# Altium schematic sheet Z_Extruder_Motor_Drivers.SchDoc
size A
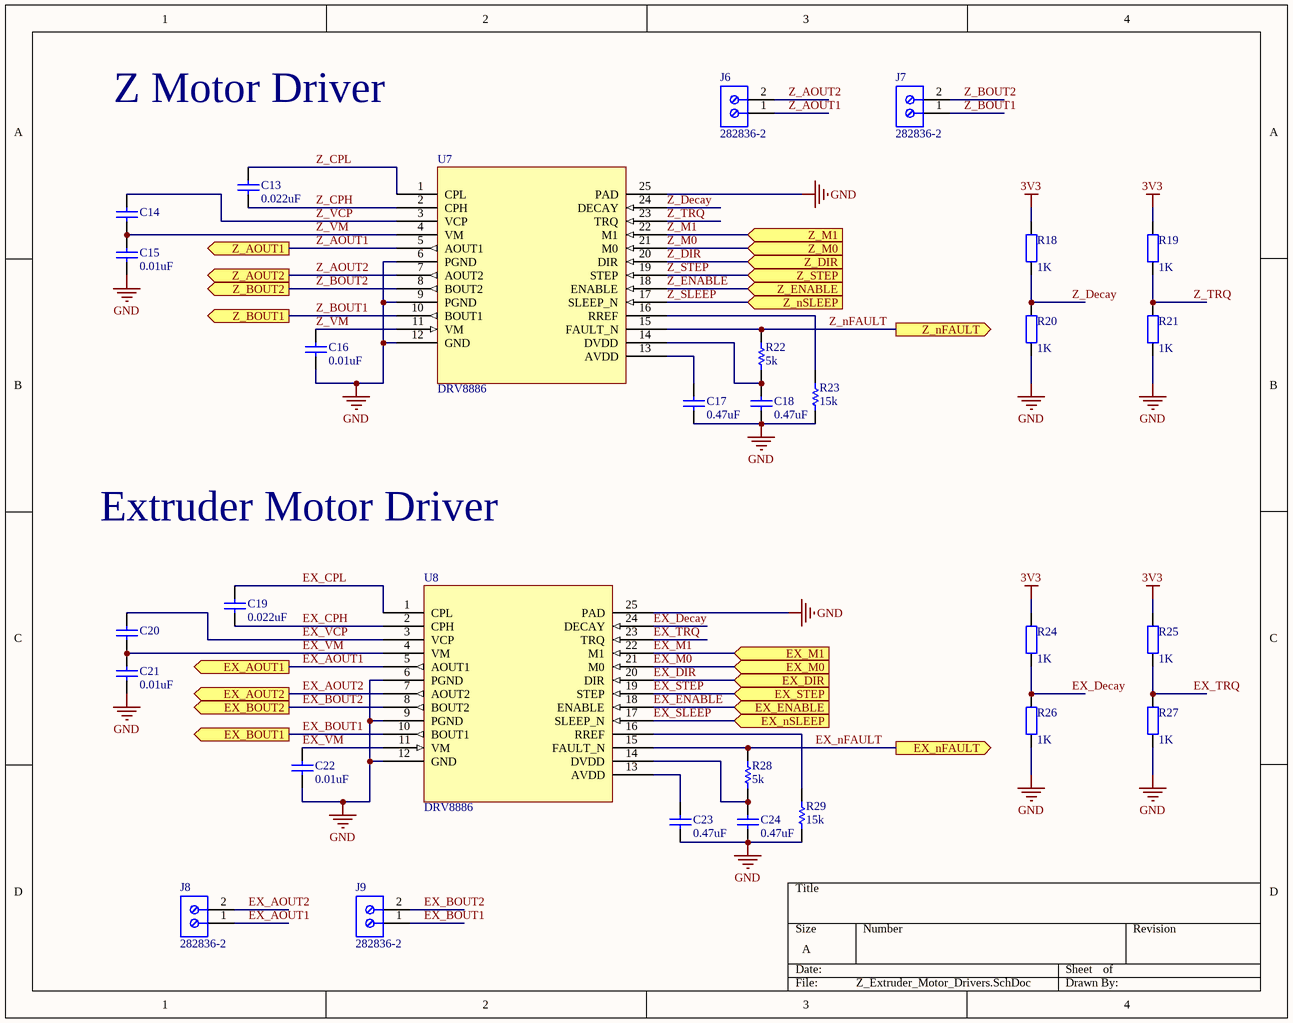
[diagram p0: Z_Extruder_Motor_Drivers.SchDoc]

## Parts
C13  0.022uF  [CAPC1608X87X35ML15T15]
C14  0.22uF  [TDK-C1608-2_A_M]  (value not drawn)
C15  0.01uF  [CAPC1608X87X35LL15T15]
C16  0.01uF  [CAPC1608X87X35LL15T15]
C17  0.47uF  [CAPC1608X90X35ML15T15]
C18  0.47uF  [CAPC1608X90X35ML15T15]
C19  0.022uF  [CAPC1608X87X35ML15T15]
C20  0.22uF  [TDK-C1608-2_A_M]  (value not drawn)
C21  0.01uF  [CAPC1608X87X35LL15T15]
C22  0.01uF  [CAPC1608X87X35LL15T15]
C23  0.47uF  [CAPC1608X90X35ML15T15]
C24  0.47uF  [CAPC1608X90X35ML15T15]
J6  282836-2  [TECO-282836-2_V]
J7  282836-2  [TECO-282836-2_V]
J8  282836-2  [TECO-282836-2_V]
J9  282836-2  [TECO-282836-2_V]
R18  value 1K  [AXIAL-0.4]  (hidden comment: ?)
R19  value 1K  [AXIAL-0.4]  (hidden comment: ?)
R20  value 1K  [AXIAL-0.4]  (hidden comment: Res2)
R21  value 1K  [AXIAL-0.4]  (hidden comment: Res2)
R22  5k  [RESC1608X55X25ML10T15]
R23  15k  [RESC1608X55X25ML10T15]
R24  value 1K  [AXIAL-0.4]  (hidden comment: ?)
R25  value 1K  [AXIAL-0.4]  (hidden comment: ?)
R26  value 1K  [AXIAL-0.4]  (hidden comment: Res2)
R27  value 1K  [AXIAL-0.4]  (hidden comment: Res2)
R28  5k  [RESC1608X55X25ML10T15]
R29  15k  [RESC1608X55X25ML10T15]
U7  DRV8886  [PWP0024B_N]
U8  DRV8886  [PWP0024B_N]

## Ports
EX_AOUT1 (out), EX_AOUT2 (out), EX_BOUT1 (out), EX_BOUT2 (out), EX_DIR (in), EX_ENABLE (in), EX_M0 (in), EX_M1 (in), EX_nFAULT (out), EX_nSLEEP (in), EX_STEP (in), Z_AOUT1 (out), Z_AOUT2 (out), Z_BOUT1 (out), Z_BOUT2 (out), Z_DIR (in), Z_ENABLE (in), Z_M0 (in), Z_M1 (in), Z_nFAULT (out), Z_nSLEEP (in), Z_STEP (in)

## Nets
3V3: R18.2 R19.2 R24.2 R25.2
GND: C15.2 C16.2 C17.1 C18.1 C21.2 C22.2 C23.1 C24.1 R20.1 R21.1 R23.1 R26.1 R27.1 R29.1 U7.6(PGND) U7.9(PGND) U7.12(GND) U7.25(PAD) U8.6(PGND) U8.9(PGND) U8.12(GND) U8.25(PAD)
EX~{_}SLEEP: U8.17(SLEEP_N) ; port EX_nSLEEP
EX_AOUT1: J8.1 U8.5(AOUT1) ; port EX_AOUT1
EX_AOUT2: J8.2 U8.7(AOUT2) ; port EX_AOUT2
EX_BOUT1: J9.1 U8.10(BOUT1) ; port EX_BOUT1
EX_BOUT2: J9.2 U8.8(BOUT2) ; port EX_BOUT2
EX_CPH: C19.1 U8.2(CPH)
EX_CPL: C19.2 U8.1(CPL)
EX_Decay: R24.1 R26.2 U8.24(DECAY)
EX_DIR: U8.20(DIR) ; port EX_DIR
EX_ENABLE: U8.18(ENABLE) ; port EX_ENABLE
EX_M0: U8.21(M0) ; port EX_M0
EX_M1: U8.22(M1) ; port EX_M1
EX_nFAULT: R28.2 U8.15(FAULT_N) ; port EX_nFAULT
EX_STEP: U8.19(STEP) ; port EX_STEP
EX_TRQ: R25.1 R27.2 U8.23(TRQ)
EX_VCP: C20.2 U8.3(VCP)
EX_VM: C20.1 C21.1 C22.1 U8.4(VM) U8.11(VM)
Z~{_}SLEEP: U7.17(SLEEP_N) ; port Z_nSLEEP
Z_AOUT1: J6.1 U7.5(AOUT1) ; port Z_AOUT1
Z_AOUT2: J6.2 U7.7(AOUT2) ; port Z_AOUT2
Z_BOUT1: J7.1 U7.10(BOUT1) ; port Z_BOUT1
Z_BOUT2: J7.2 U7.8(BOUT2) ; port Z_BOUT2
Z_CPH: C13.1 U7.2(CPH)
Z_CPL: C13.2 U7.1(CPL)
Z_Decay: R18.1 R20.2 U7.24(DECAY)
Z_DIR: U7.20(DIR) ; port Z_DIR
Z_ENABLE: U7.18(ENABLE) ; port Z_ENABLE
Z_M0: U7.21(M0) ; port Z_M0
Z_M1: U7.22(M1) ; port Z_M1
Z_nFAULT: R22.2 U7.15(FAULT_N) ; port Z_nFAULT
Z_STEP: U7.19(STEP) ; port Z_STEP
Z_TRQ: R19.1 R21.2 U7.23(TRQ)
Z_VCP: C14.2 U7.3(VCP)
Z_VM: C14.1 C15.1 C16.1 U7.4(VM) U7.11(VM)
NetC17_2: C17.2 U7.13(AVDD)
NetC18_2: C18.2 R22.1 U7.14(DVDD)
NetC23_2: C23.2 U8.13(AVDD)
NetC24_2: C24.2 R28.1 U8.14(DVDD)
NetR23_2: R23.2 U7.16(RREF)
NetR29_2: R29.2 U8.16(RREF)

## Notes on the sheet
- Z Motor Driver
- Extruder Motor Driver

## Library data of the parts
C13 C19 = CMP-2006-03139-1: Part Number: C0603C223K4RACTU; Manufacturer: Kemet
C14 C20 = CMP-2000-05394-1: Cap Ceramic, 0.22 uF, +/- 10%, -55 to 125 degC, 2-Pin SMD (0603), RoHS, Tape and Reel; Manufacturer: TDK; PCN Part Number: MLCCPartNumberChange30/Nov/2012; Capacitance: 0.22µF; Other Names: 445-7408-1; Design Resources: 20WNon-IsolatedBuckLEDDriverUsingPLLNK460KG; Online Catalog: CSeries,GeneralPurpose; Kits: 445-9014-KIT-ND-KITMLCC100PF-22UF060310-50V445-9003-KIT-ND-KITCAPCERHICAPMLCCSMD445-173086-KIT-ND-C0402-2220X7R6.3-50V1,000PF-; Temperature Coefficient: X7R; Product Training Modules: CSeriesGeneralApplicationsSEAT,CCV,andTVCLDesignToolsGuidetoReplacinganElectrolyticCapacitorwithanMLCC; Voltage - Rated: 50V; Ratings: -; Lead Spacing: -; Package Description: 2-Pin Chip Capacitor, Body 1.7 x 0.9 mm; Datasheet URL: https://datasheet.ciiva.com/24218/c1608x7r1h224k080ab-264841-24218813.pdf; Applications: GeneralPurpose; Series: C; Manufacturer URL: http://www.tdk.com/; Size / Dimension: 0.063"Lx0.031"W(1.60mmx0.80mm); Features: -; Tolerance: ±10%; Package Reference: 603; Family: CeramicCapacitors; Standard Package: 1; RoHS Information: RoHSCertificate-MLCC; Thickness (Max): 0.035"(0.90mm); Package / Case: 0603(1608Metric); Operating Temperature: -55degC~125degC; Datasheet Version: Sep-13; Mounting Type: SurfaceMount,MLCC; Lead Style: -; Height - Seated (Max): -; Packaging: CutTape(CT); Category: Capacitors
C15 C16 C21 C22 = CMP-2006-03299-1: Manufacturer: Kemet; Part Number: C0603X103K5RACTU
C17 C18 C23 C24 = CMP-2006-04187-1: Part Number: 06033C474KAT2A; Manufacturer: AVX Interconnect / Elco
J6-J9 = CMP-1684-00017-1: Female Header, Pitch 5 mm, 1 x 2 Position, Height 10 mm, Tail Length 3.5 mm, Rohs, Bulk; Manufacturer: TE Connectivity; Wire Gauge: 16-30AWG; Product Training Modules: Wire-to-BoardEurostyleTerminalBlocks; Clamp Material - Plating: Brass-NickelPlated; Voltage: 300V; Mating Orientation: HorizontalwithBoard; Current: 13.5A; Pitch: 0.197"(5.00mm); Screw Thread: M3; 3D Model: 282836-2.pdf; Other Names: 5ULV-02B / A98076; Dynamic Catalog: BuchananSeries; Number of Levels: 1; Torque - Screw: 0.68Nm(6Lb-In); Featured Product: EurostyleTerminalBlockConnectors; Positions Per Level: 2; Wire Termination: Screw-RisingCageClamp; Datasheet URL: http://www.te.com.cn/commerce/DocumentDelivery/DDEController?Action=showdoc&DocId=Catalog+Section%7F1308389_EUROSTYLE_TERMINAL_BLOCKS%7F0607%7Fpdf%7FEnglish%7FENG_CS_1308389_EUROSTYLE_TERMINAL_BLOCKS_0607.pdf%7F282836-2; Color: Green; Family: TerminalBlocks-WiretoBoard; RoHS Information: 282836-2StatementofCompliance; Standard Package: 300; Contact Material - Plating: Brass-TinPlated; Manufacturer URL: http://www.te.com; Housing Material: Polyamide(PA66),Nylon6/6; Features: Interlocking(Side); Package Description: Female Header, Pitch 5 mm, 1 x 2 Position, Height 10 mm, Tail Length 3.5 mm; Mounting Type: ThroughHole; Package Reference: THD; Packaging: Bulk; Series: Buchanan; Category: Connectors,Interconnects; Screw Material - Plating: Brass-NickelPlated
R18-R21 R24-R27 = Res2: Resistor; Published: 8-Jun-2000; LatestRevisionDate: 17-Jul-2002; LatestRevisionNote: Re-released for DXP Platform.; PackageReference: AXIAL-0.4; Publisher: Altium Limited; PackageDescription: Axial Device, Thru-Hole; 2 Leads; 0.4 in Pin Spacing
R22 R23 R28 R29 = CMP-2100-03667-1: Chip Resistor, 0 Ohm, +/- 5%, 0.1 W, -55 to 155 degC, 0603 (1608 Metric), RoHS, Tape and Reel; Manufacturer: Yageo; Temperature Coefficient: 200ppm/degreesC; Voltage Rating: 50V; Power Rating: 100mW; Resistance: 0mOhm; Width: 0.8mm; Max Operating Temperature: 155degC; Tolerance: 5%; Package Reference: 0603; Height: 0.45mm; Depth: 0.8mm; Package Description: 2-Pin Surface Mount Device, Body 1.6 x 0.8 mm; Termination: SMD/SMT; Package Quantity: 5000; Case/Package: 0603; Case Code (Imperial): 0603; Radiation Hardening: No; Number of Pins: 2; Length: 1.6mm; Lead Free: LeadFree; Voltage Rating (DC): 50V; Military Standard: Not; Datasheet URL: http://www.yageo.com/NewPortal/yageodocoutput?fileName=/pdf/R-Chip/PYu-RC_Group_51_RoHS_L_5.pdf; Manufacturer URL: http://www.yageo.com/; Packaging: TapeandReel; Case Code (Metric): 1608; Min Operating Temperature: -55degC; Composition: ThickFilm; RoHSCompliant: true; Contact Plating: Tin; Datasheet Version: Rev. 5, 10/2016; REACH SVHC: NoSVHC